# Altium schematic sheet Processor.SchDoc
size A4; SheetNumber: 2; SheetTotal: 10
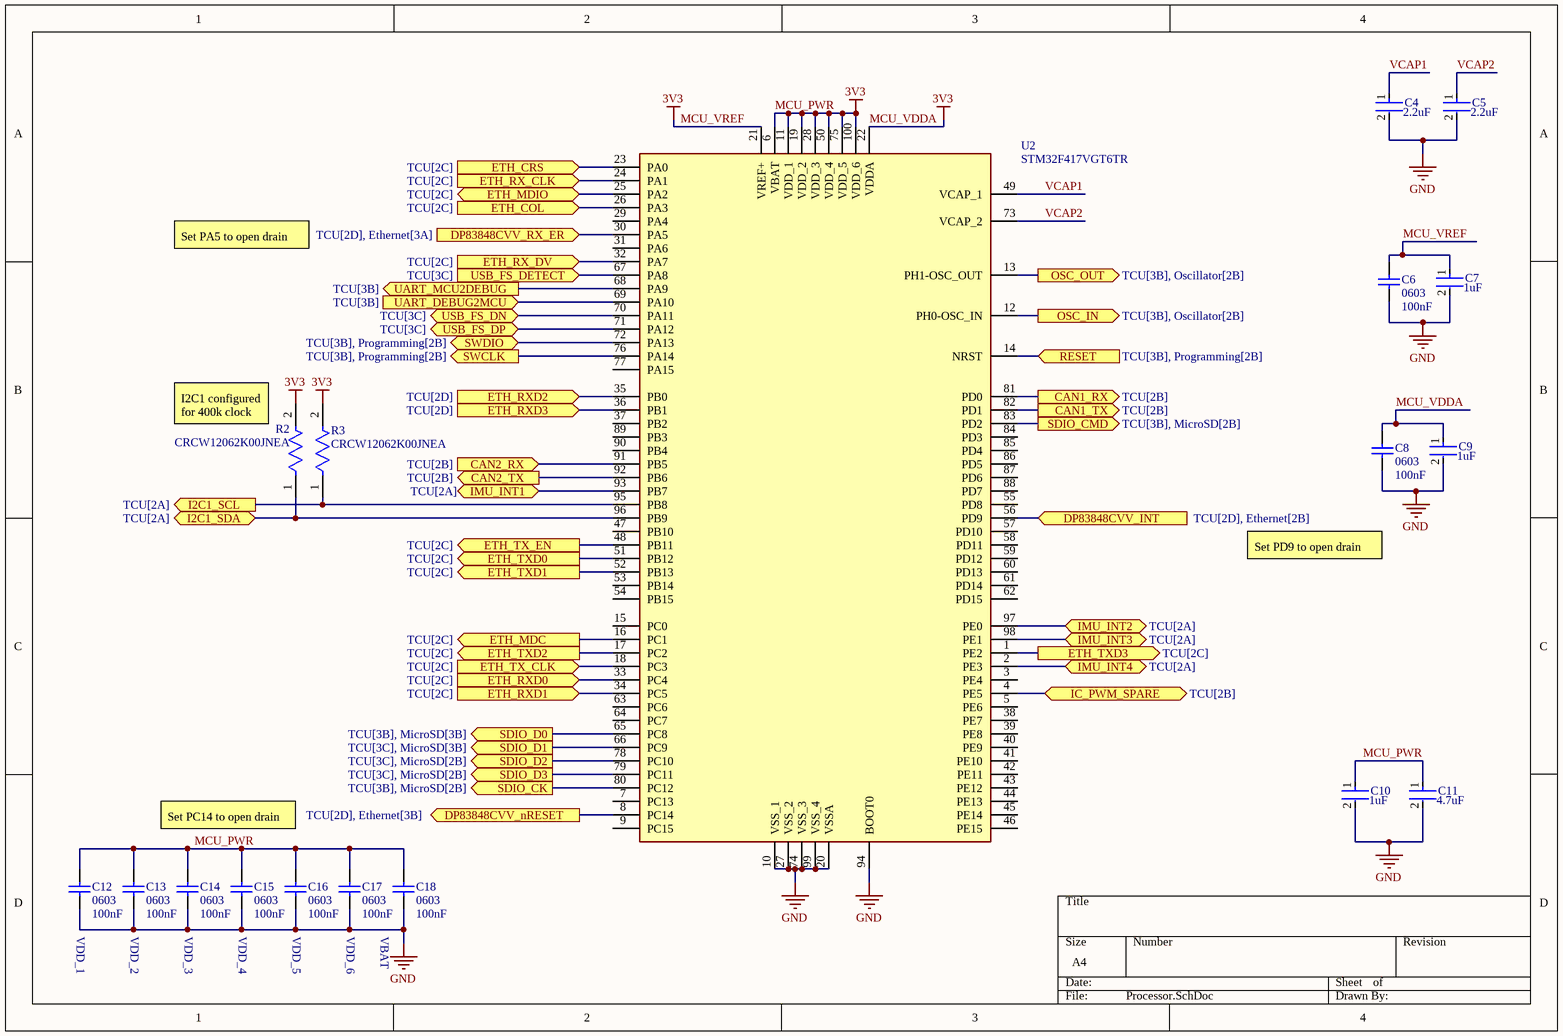
[diagram p0: Processor.SchDoc]

## Parts
C4  Capacitance: 2.2uF  [FP-C0603C225K4PACTU-MFG]  (hidden comment: C0603C225K4PACTU)
C5  Capacitance: 2.2uF  [FP-C0603C225K4PACTU-MFG]  (hidden comment: C0603C225K4PACTU)
C6  Case Code (Imperial): 0603  Capacitance: 100nF  [CAPC1608X87X35NL15T15]  (hidden comment: C0603X104K5RACTU)
C7  Capacitance: 1uF  [FP-CL10-IPC_C]  (hidden comment: CL10A105KA8NNNC)
C8  Case Code (Imperial): 0603  Capacitance: 100nF  [CAPC1608X87X35NL15T15]  (hidden comment: C0603X104K5RACTU)
C9  Capacitance: 1uF  [FP-CL10-IPC_C]  (hidden comment: CL10A105KA8NNNC)
C10  Capacitance: 1uF  [FP-CL10-IPC_C]  (hidden comment: CL10A105KA8NNNC)
C11  Capacitance: 4.7uF  [FP-C1005-050-0_15-MFG]  (hidden comment: C1005X5R1A475K050BC)
C12  Case Code (Imperial): 0603  Capacitance: 100nF  [CAPC1608X87X35NL15T15]  (hidden comment: C0603X104K5RACTU)
C13  Case Code (Imperial): 0603  Capacitance: 100nF  [CAPC1608X87X35NL15T15]  (hidden comment: C0603X104K5RACTU)
C14  Case Code (Imperial): 0603  Capacitance: 100nF  [CAPC1608X87X35NL15T15]  (hidden comment: C0603X104K5RACTU)
C15  Case Code (Imperial): 0603  Capacitance: 100nF  [CAPC1608X87X35NL15T15]  (hidden comment: C0603X104K5RACTU)
C16  Case Code (Imperial): 0603  Capacitance: 100nF  [CAPC1608X87X35NL15T15]  (hidden comment: C0603X104K5RACTU)
C17  Case Code (Imperial): 0603  Capacitance: 100nF  [CAPC1608X87X35NL15T15]  (hidden comment: C0603X104K5RACTU)
C18  Case Code (Imperial): 0603  Capacitance: 100nF  [CAPC1608X87X35NL15T15]  (hidden comment: C0603X104K5RACTU)
R2  CRCW12062K00JNEA  [FP-CRCW1206-e3-IPC_B]
R3  CRCW12062K00JNEA  [FP-CRCW1206-e3-IPC_B]
U2  STM32F417VGT6TR  [STM-LQFP100_N]

## Ports
CAN1_RX (out, see TCU[2B]), CAN1_TX (out, see TCU[2B]), CAN2_RX (in, see TCU[2B]), CAN2_TX (out, see TCU[2B]), DP83848CVV_INT (in, see TCU[2D], Ethernet[2B]), DP83848CVV_nRESET (out, see TCU[2D], Ethernet[3B]), DP83848CVV_RX_ER (in, see TCU[2D], Ethernet[3A]), ETH_COL (in, see TCU[2C]), ETH_CRS (in, see TCU[2C]), ETH_MDC (out, see TCU[2C]), ETH_MDIO (bidir, see TCU[2C]), ETH_RX_CLK (in, see TCU[2C]), ETH_RX_DV (in, see TCU[2C]), ETH_RXD0 (in, see TCU[2C]), ETH_RXD1 (in, see TCU[2C]), ETH_RXD2 (in, see TCU[2D]), ETH_RXD3 (in, see TCU[2D]), ETH_TX_CLK (in, see TCU[2C]), ETH_TX_EN (out, see TCU[2C]), ETH_TXD0 (out, see TCU[2C]), ETH_TXD1 (out, see TCU[2C]), ETH_TXD2 (out, see TCU[2C]), ETH_TXD3 (out, see TCU[2C]), I2C1_SCL (out, see TCU[2A]), I2C1_SDA (bidir, see TCU[2A]), IC_PWM_SPARE (bidir, see TCU[2B]), IMU_INT1 (bidir, see TCU[2A]), IMU_INT2 (bidir, see TCU[2A]), IMU_INT3 (bidir, see TCU[2A]), IMU_INT4 (bidir, see TCU[2A]), OSC_IN (out, see TCU[3B], Oscillator[2B]), OSC_OUT (out, see TCU[3B], Oscillator[2B]), RESET (in, see TCU[3B], Programming[2B]), SDIO_CK (out, see TCU[3B], MicroSD[2B]), SDIO_CMD (out, see TCU[3B], MicroSD[2B]), SDIO_D0 (out, see TCU[3B], MicroSD[3B]), SDIO_D1 (out, see TCU[3C], MicroSD[3B]), SDIO_D2 (out, see TCU[3C], MicroSD[2B]), SDIO_D3 (out, see TCU[3C], MicroSD[2B]), SWCLK (out, see TCU[3B], Programming[2B]), SWDIO (bidir, see TCU[3B], Programming[2B]), UART_DEBUG2MCU (in, see TCU[3B]), UART_MCU2DEBUG (out, see TCU[3B]), USB_FS_DETECT (in, see TCU[3C]), USB_FS_DN (bidir, see TCU[3C]), USB_FS_DP (bidir, see TCU[3C])

## Nets
GND: C4.2 C5.2 C6.2 C7.2 C8.2 C9.2 C10.2 C11.2 C12.1 C13.1 C14.1 C15.1 C16.1 C17.1 C18.1 U2.10(VSS_1) U2.20(VSSA) U2.27(VSS_2) U2.74(VSS_3) U2.94(BOOT0) U2.99(VSS_4)
MCU_PWR: C6.1 C7.1 C8.1 C9.1 C10.1 C11.1 C12.2 C13.2 C14.2 C15.2 C16.2 C17.2 C18.2 R2.2 R3.2 U2.6(VBAT) U2.11(VDD_1) U2.19(VDD_2) U2.21(VREF+) U2.22(VDDA) U2.28(VDD_3) U2.50(VDD_4) U2.75(VDD_5) U2.100(VDD_6)  [also labelled 3V3, MCU_VDDA, MCU_VREF]
CAN1_RX: U2.81(PD0) ; port CAN1_RX
CAN1_TX: U2.82(PD1) ; port CAN1_TX
CAN2_RX: U2.91(PB5) ; port CAN2_RX
CAN2_TX: U2.92(PB6) ; port CAN2_TX
DP83848CVV_INT: U2.56(PD9) ; port DP83848CVV_INT
DP83848CVV_nRESET: U2.8(PC14) ; port DP83848CVV_nRESET
DP83848CVV_RX_ER: U2.30(PA5) ; port DP83848CVV_RX_ER
ETH_COL: U2.26(PA3) ; port ETH_COL
ETH_CRS: U2.23(PA0) ; port ETH_CRS
ETH_MDC: U2.16(PC1) ; port ETH_MDC
ETH_MDIO: U2.25(PA2) ; port ETH_MDIO
ETH_RX_CLK: U2.24(PA1) ; port ETH_RX_CLK
ETH_RX_DV: U2.32(PA7) ; port ETH_RX_DV
ETH_RXD0: U2.33(PC4) ; port ETH_RXD0
ETH_RXD1: U2.34(PC5) ; port ETH_RXD1
ETH_RXD2: U2.35(PB0) ; port ETH_RXD2
ETH_RXD3: U2.36(PB1) ; port ETH_RXD3
ETH_TX_CLK: U2.18(PC3) ; port ETH_TX_CLK
ETH_TX_EN: U2.48(PB11) ; port ETH_TX_EN
ETH_TXD0: U2.51(PB12) ; port ETH_TXD0
ETH_TXD1: U2.52(PB13) ; port ETH_TXD1
ETH_TXD2: U2.17(PC2) ; port ETH_TXD2
ETH_TXD3: U2.1(PE2) ; port ETH_TXD3
I2C1_SCL: R3.1 U2.95(PB8) ; port I2C1_SCL
I2C1_SDA: R2.1 U2.96(PB9) ; port I2C1_SDA
IC_PWM_SPARE: U2.4(PE5) ; port IC_PWM_SPARE
IMU_INT1: U2.93(PB7) ; port IMU_INT1
IMU_INT2: U2.97(PE0) ; port IMU_INT2
IMU_INT3: U2.98(PE1) ; port IMU_INT3
IMU_INT4: U2.2(PE3) ; port IMU_INT4
OSC_IN: U2.12(PH0-OSC_IN) ; port OSC_IN
OSC_OUT: U2.13(PH1-OSC_OUT) ; port OSC_OUT
RESET: U2.14(NRST) ; port RESET
SDIO_CK: U2.80(PC12) ; port SDIO_CK
SDIO_CMD: U2.83(PD2) ; port SDIO_CMD
SDIO_D0: U2.65(PC8) ; port SDIO_D0
SDIO_D1: U2.66(PC9) ; port SDIO_D1
SDIO_D2: U2.78(PC10) ; port SDIO_D2
SDIO_D3: U2.79(PC11) ; port SDIO_D3
SWCLK: U2.76(PA14) ; port SWCLK
SWDIO: U2.72(PA13) ; port SWDIO
UART_DEBUG2MCU: U2.69(PA10) ; port UART_DEBUG2MCU
UART_MCU2DEBUG: U2.68(PA9) ; port UART_MCU2DEBUG
USB_FS_DETECT: U2.67(PA8) ; port USB_FS_DETECT
USB_FS_DN: U2.70(PA11) ; port USB_FS_DN
USB_FS_DP: U2.71(PA12) ; port USB_FS_DP
VCAP1: C4.1 U2.49(VCAP_1)
VCAP2: C5.1 U2.73(VCAP_2)

Not connected (* = marked no-connect by the designer): U2 3(PE4) 5(PE6) 7(PC13) 9(PC15) 15(PC0) 29(PA4) 31(PA6) 37(PB2) 38(PE7) 39(PE8) 40(PE9) 41(PE10) 42(PE11) 43(PE12) 44(PE13) 45(PE14) 46(PE15) 47(PB10) 53(PB14) 54(PB15) 55(PD8) 57(PD10) 58(PD11) 59(PD12) 60(PD13) 61(PD14) 62(PD15) 63(PC6) 64(PC7) 77(PA15) 84(PD3) 85(PD4) 86(PD5) 87(PD6) 88(PD7) 89(PB3) 90(PB4)

## Notes on the sheet
- Set PA5 to open drain
- (near R2) I2C1 configured for 400k clock
- Set PD9 to open drain
- Set PC14 to open drain
- VDD_1
- VDD_2
- VDD_3
- VDD_4
- VDD_5
- VDD_6
- VBAT

## Library data of the parts
C4 C5 = CMP-2006-02259-2: CAP CER 2.2UF 16V X5R 0603; Dielectric Material: Ceramic; Tolerance: 10%; Dissipation Factor: 5%; Series: C; Voltage Rating (DC): 16V; REACH SVHC: No SVHC; RoHS Compliant: Yes; Number of Pins: 2; Max Operating Temperature: 85°C; Voltage Rating: 16V; Min Operating Temperature: -55°C; Termination: SMD/SMT; Dielectric: X5R; Packaging: Tape and Reel; Contact Plating: Tin; Case Code (Metric): 1608; Height: 0.8mm; Case/Package: 0603; Width: 0.8mm; Construction: Flat; Depth: 0.8mm; Thickness: 0.034inch; Radiation Hardening: No; Length: 1.6mm; Mount: Surface Mount; Case Code (Imperial): 0603; Voltage: 16V; Package Quantity: 1; Lead Free: Lead Free
C6 C8 C12-C18 = CMP-2006-03300-1: Manufacturer: Kemet; Dielectric Material: Ceramic; Tolerance: 10%; Voltage Rating: 50V; Dielectric: X7R; Dissipation Factor: 2.5%; Part Number: C0603X104K5RACTU; Supplier 1: Digi-Key; Supplier Part Number 1: 399-7969-1-ND; Manufacturer Part Number: C0603X104K5RACTU; Stock 1: 2206541; Pricing 1: 1 = 0.21000, 10 = 0.14500, 100 = 0.07340, 500 = 0.05024, 1000 = 0.04444 (USD); RoHS: Yes; Mount: Surface Mount; Case/Package: 0603; Number of Pins: 2; Case Code (Metric): 1608; Min Operating Temperature: -55°C; Max Operating Temperature: 125°C; Packaging: Tape and Reel; Package Quantity: 1; Voltage Rating (DC): 50V; Termination: SMD/SMT; Voltage: 50V; Features: Soft Termination; Length: 1.6mm; Height: 0.8mm; Width: 0.8mm; Depth: 0.8mm; Thickness: 0.034inch; Radiation Hardening: No; REACH SVHC: No SVHC; ComponentLink1URL: https://datasheet.ciiva.com/7823/1776088-7823908.pdf?src-supplier=Element14; ComponentLink1Description: https://datasheet.ciiva.com/7823/1776088-7823908.pdf?src-supplier=Element14; ComponentLink2URL: https://datasheet.ciiva.com/26948/getdatasheetpartid-385607-26948458.pdf?src-supplier=Verical; ComponentLink2Description: https://datasheet.ciiva.com/26948/getdatasheetpartid-385607-26948458.pdf?src-supplier=Verical; ComponentLink3URL: https://datasheet.ciiva.com/7823/1776088-7823909.pdf?src-supplier=Element14; ComponentLink3Description: https://datasheet.ciiva.com/7823/1776088-7823909.pdf?src-supplier=Element14; ComponentLink4URL: https://datasheet.ciiva.com/6279/kem-c1013-x7r-ft-cap-smd-6279993.pdf?src-supplier=Digi-Key; ComponentLink4Description: https://datasheet.ciiva.com/6279/kem-c1013-x7r-ft-cap-smd-6279993.pdf?src-supplier=Digi-Key; ComponentLink5URL: https://datasheet.ciiva.com/28533/1918693-28533212.pdf?src-supplier=Element14; ComponentLink5Description: https://datasheet.ciiva.com/28533/1918693-28533212.pdf?src-supplier=Element14; ComponentLink6URL: https://datasheet.ciiva.com/6279/kem-c1013-x7r-ft-cap-smd-6279999.pdf?src-supplier=Digi-Key; ComponentLink6Description: https://datasheet.ciiva.com/6279/kem-c1013-x7r-ft-cap-smd-6279999.pdf?src-supplier=Digi-Key; ComponentLink7URL: https://datasheet.ciiva.com/6279/kem-c1013-x7r-ft-cap-smd-6279990.pdf?src-supplier=Digi-Key; ComponentLink7Description: https://datasheet.ciiva.com/6279/kem-c1013-x7r-ft-cap-smd-6279990.pdf?src-supplier=Digi-Key; ComponentLink8URL: https://datasheet.ciiva.com/14597/70096394-14597743.pdf?src-supplier=Allied+Electronics; ComponentLink8Description: https://datasheet.ciiva.com/14597/70096394-14597743.pdf?src-supplier=Allied+Electronics
C7 C9 C10 = CMP-13271-004127-1: Cap Ceramic 1uF 25V X5R ±10% Pad SMD 0603 +85°C T/R; Height: 0.8mm; Depth: 0.8mm; Package Quantity: 1; Mount: Surface Mount; Contact Plating: Tin; Voltage Rating: 25V; Dielectric: X5R; Packaging: Tape and Reel; Material: Ceramic; Case Code (Metric): 1608; Length: 1.6mm; Voltage: 25V; Min Operating Temperature: -55°C; Width: 0.031inch; Tolerance: 10%; Case/Package: 0603; Radiation Hardening: No; Case Code (Imperial): 0603; Thickness: 0.035inch; Lead Free: Lead Free; Max Operating Temperature: 85°C; Voltage Rating (DC): 25V
C11 = CMP-2000-05997-2: CAP CER 4.7UF 10V X5R 0402; Dielectric Material: Ceramic; Tolerance: 10%; Series: C; Package Quantity: 10000; Max Operating Temperature: 85°C; Case Code (Imperial): 0402; Lead Free: Lead Free; Voltage Rating (DC): 10V; Packaging: Cut Tape; Voltage Rating: 10V; Min Operating Temperature: -55°C; Dielectric: X5R; Thickness: 0.022inch; Width: 0.02inch; Case/Package: 0402; Case Code (Metric): 1005; Length: 0.039inch; RoHS Compliant: Yes; REACH SVHC: No SVHC; Mount: Surface Mount
R2 R3 = CMP-2003-02030-2: RES Thick Film, 2kΩ, 5%, 0.25W, 200ppm/°C, 1206; Resistance: 2kR; Max Power Dissipation: 250mW; Voltage Rating: 200V; Case Code (Imperial): 1206; Min Operating Temperature: -55°C; Number of Pins: 2; Tolerance: 5%; Contact Plating: Tin; Temperature Coefficient: 200ppm/°C; Features: Automotive AEC-Q200; Max Operating Temperature: 155°C; Military Standard: Not; Package Quantity: 1; Radiation Hardening: No; Composition: Thick Film; Weight: 0.000353oz; Number of Terminations: 2; Width: 0.063inch; Length: 3.2mm; Depth: 1.6mm; Voltage Rating (DC): 200V; Power Rating: 250mW; Height: 0.024inch; Case/Package: 1206; Lead Free: Lead Free; Case Code (Metric): 3216; Packaging: Tape and Reel
U2 = STM32F417VGT6TR: RISC Microcontroller, 32-Bit, FLASH, CORTEX-M4 CPU, 168MHz, CMOS, PQFP100; Manufacturer: STMicroelectronics; Package Body Material: Plastic; Max Frequency: 26MHz; Number of I/O Lines: 82; Package Equivalence Code: QFP100,.63SQ,20; Power Supplies: 2/3.3V; Speed: 168RPM; Max Supply Current: 109mA; Max Supply Voltage: 3.6V; Min Supply Voltage: 1.8V; Supply Voltage-Nom: 3.3V; Qualification Status: Not Qualified; Supplier 1: Mouser; Manufacturer Part Number: STM32F417VGT6TR; RoHS: Yes; Category: Microcontrollers; Stock 1: 905; Pricing 1: 1=15.23, 10=14, 25=13.42, 50=13.42, 100=11.9, 1000=11.87, 10000=11.87 (USD); Package Code: LFQFP; Number of Pins: 100; Package Shape: Square; Min Operating Temperature: -40°C; Max Operating Temperature: 85°C; JESD-30 Code: S-PQFP-G100; Package Style: FLATPACK, LOW PROFILE, FINE PITCHMeter; Surface Mount: Yes; Technology: CMOS; Terminal Form: Gull Wing; Terminal Position: QUAD; Length: 14mm; Width: 14mm; Height - Seated (Max): 1.6mm; Terminal Pitch: 0.5mm; Reach SVHC Compliant: Yes; RoHS Compliant: Yes; Temperature Grade: INDUSTRIAL; ComponentLink1URL: https://datasheet.ciiva.com:443/pdfs/VipMasterIC/IC/SGST/SGST-S-A0002807758/SGST-S-A0002807758-1.pdf?src-supplier=IHS+Markit; ComponentLink1Description: https://datasheet.ciiva.com:443/pdfs/VipMasterIC/IC/SGST/SGST-S-A0002807758/SGST-S-A0002807758-1.pdf?src-supplier=IHS+Markit; ComponentLink2URL: https://datasheet.ciiva.com/29987/dm00035129-29987056.pdf?src-supplier=Avnet; ComponentLink2Description: https://datasheet.ciiva.com/29987/dm00035129-29987056.pdf?src-supplier=Avnet; Supplier Part Number 1: 511-STM32F417VGT6TR